# EAGLE design ttd (EAGLE 6.4)
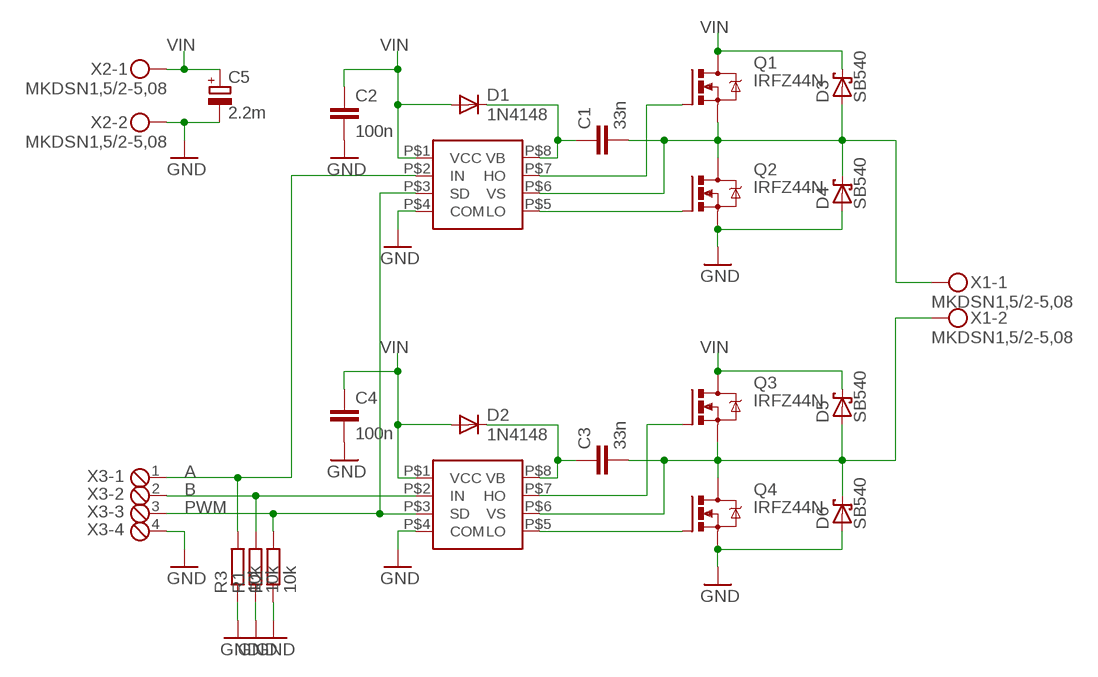
[diagram p0: schematic, sheet 1]

## Parts
C1  33n  C-EU050-025X075  [C050-025X075]
C2  100n  C-EU075-032X103  [C075-032X103]
C3  33n  C-EU050-025X075  [C050-025X075]
C4  100n  C-EU075-032X103  [C075-032X103]
C5  2.2m  CPOL-EUE7.5-18  [E7,5-18]
D1  1N4148  1N4148DO35-10  [DO35-10]
D2  1N4148  1N4148DO35-10  [DO35-10]
D3  SB540  SCHOTTKY-DIODEDO201T15  [DO201T15]
D4  SB540  SCHOTTKY-DIODEDO201T15  [DO201T15]
D5  SB540  SCHOTTKY-DIODEDO201T15  [DO201T15]
D6  SB540  SCHOTTKY-DIODEDO201T15  [DO201T15]
Q1  IRFZ44N  IRF540  [TO220BV]
Q2  IRFZ44N  IRF540  [TO220BV]
Q3  IRFZ44N  IRF540  [TO220BV]
Q4  IRFZ44N  IRF540  [TO220BV]
R1  10k  R-EU_0207/7  [0207/7]
R2  10k  R-EU_0207/7  [0207/7]
R3  10k  R-EU_0207/10  [0207/10]
U$1  IR2104  [IR2104_DIL]
U$2  IR2104  [IR2104_DIL]
X1  MKDSN1,5/2-5,08  [MKDSN1,5/2-5,08]
X2  MKDSN1,5/2-5,08  [MKDSN1,5/2-5,08]
X3  MPT4  [4POL254]

## Nets
A: R3.2 U$1.P$2(IN) X3.1
B: R1.2 U$2.P$2(IN) X3.2
GND [Supply]: C2.2 C4.2 C5.- D4.A D6.A Q2.S Q4.S R1.1 R2.1 R3.1 U$1.P$4(COM) U$2.P$4(COM) X2.2 X3.4
N$1: Q2.G U$1.P$5(LO)
N$2: Q4.G U$2.P$5(LO)
N$3: Q1.G U$1.P$7(HO)
N$4 [Motor]: C1.2 D3.A D4.C Q1.S Q2.D U$1.P$6(VS) X1.1
N$6: C1.1 D1.C U$1.P$8(VB)
N$7 [Motor]: C3.2 D5.A D6.C Q3.S Q4.D U$2.P$6(VS) X1.2
N$8: Q3.G U$2.P$7(HO)
N$9: C3.1 D2.C U$2.P$8(VB)
PWM: R2.2 U$1.P$3(SD) U$2.P$3(SD) X3.3
VIN [Supply]: C2.1 C4.1 C5.+ D1.A D2.A D3.C D5.C Q1.D Q3.D U$1.P$1(VCC) U$2.P$1(VCC) X2.1

## Library data of the parts
C1 C3 = rcl:C-EU: CAPACITOR, European symbol
C2 C4 = resistor:C-EU: CAPACITOR, European symbol
C5 = resistor:CPOL-EU: POLARIZED CAPACITOR, European symbol
D1 D2 = diode:1N4148: DIODE high speed (Philips)
D3-D6 = diode:SCHOTTKY-DIODE: Schottky Diode
Q1-Q4 = transistor-power:IRF540: HEXFET Power MOSFET
R1-R3 = resistor:R-EU_: RESISTOR, European symbol
U$1 U$2 = ttd:IR2104
X1 X2 = con-phoenix-508:MKDSN1,5/2-5,08: MKDSN 1,5/ 2-5,08 Printklemme Nennstrom: 13,5 A Nennspannung: 250 V Rastermaß: 5,08 mm Polzahl: 2 Anschlussart: Schraubanschluss Montage: Löten Anschlussrichtung Leiter/Platine: 0 ° Artikelnummer: 1729128 Source: http://eshop.phoenixcontact.com .. 1729128.pdf; MPN: MKDSN 1,5/2-5.08; OC_FARNELL: 1792903; OC_NEWARK: 30M2397
X3 = con-phoenix-254:MPT4: PHOENIX CONNECTOR; OC_FARNELL: unknown; OC_NEWARK: unknown

## Net classes
0 Signal: width 0.254 mm
1 Supply: width 1.016 mm
2 Motor: width 1.016 mm

## Board
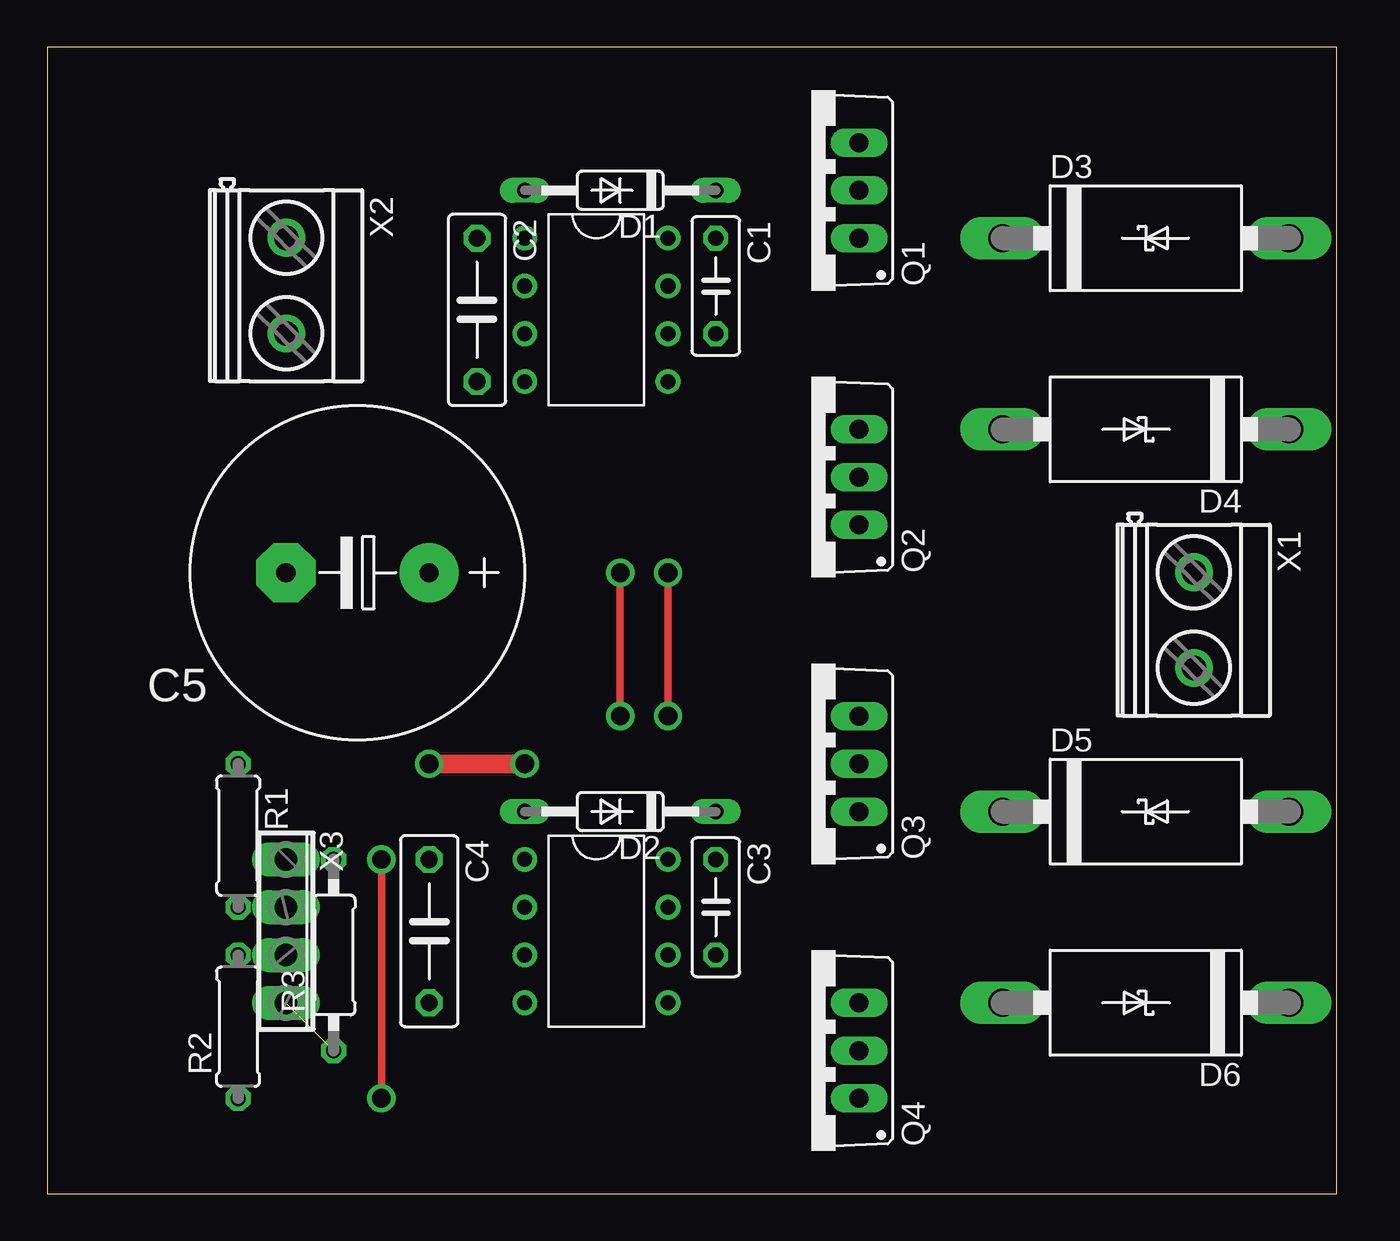
[diagram p1: board, top side]
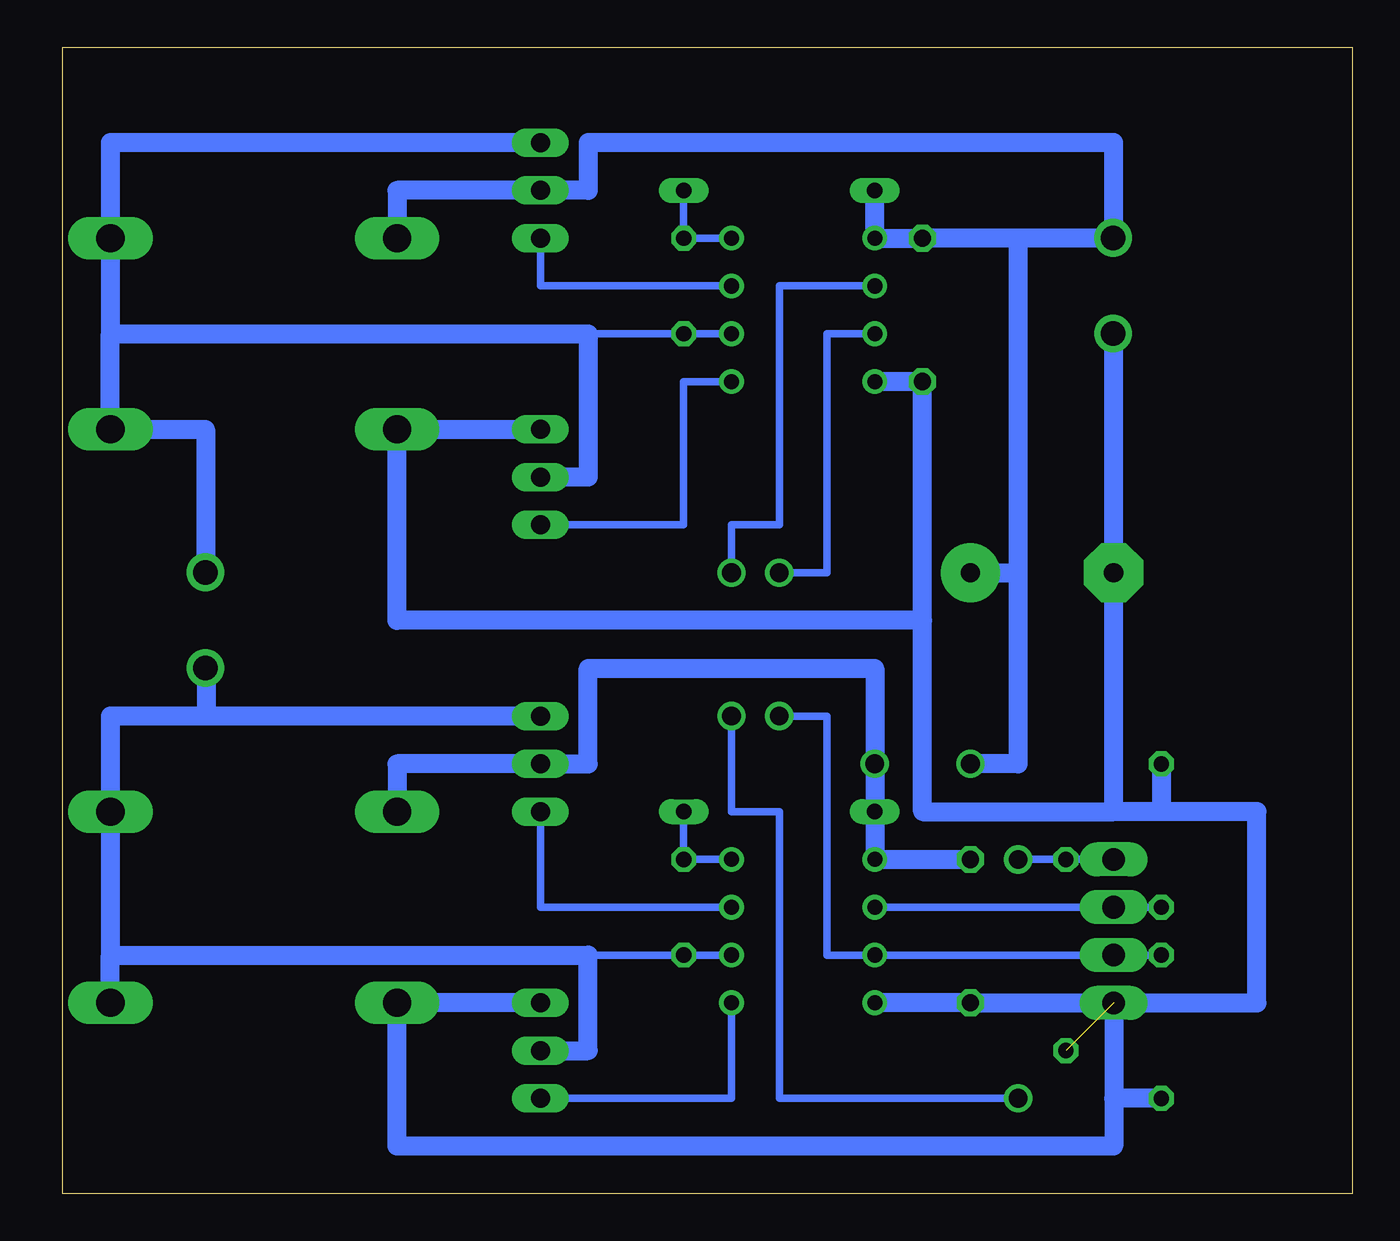
[diagram p2: board, bottom side, seen from below]

Size 68.58 x 60.96 mm. Coordinates in mm from the lower left corner, seen from the top.
Outline: 0,0 68.58,0 68.58,60.96 0,60.96 0,0
Copper layers (1*16): Top 0.035mm / dielectric 1.5mm / Bottom 0.035mm
Design rules "default *": minimum track width 10mil, minimum drill 24mil, track to track 8mil, track to pad 8mil, pad to pad 8mil, via to via 8mil, smd to smd 8mil, copper to edge 40mil, drill to drill 8mil, minimum pad ring 10mil, minimum via ring 8mil, stop-mask expansion 4mil, vias tented up to drill 0mil, thermal gap 10mil

### Footprints (pad centres in the part's own frame; a part is rotated, then mirrored left to right if it is on the bottom)
C050-025X075 = drill 0.813 octagon: 1 -2.54,0; 2 2.54,0
C075-032X103 = drill 0.914 octagon: 1 -3.81,0; 2 3.81,0
E7,5-18 = drill 1.016 pad 3.15: + -3.81,0 | drill 1.016 pad 3.15 octagon: - 3.81,0
DO35-10 = drill 0.813 long: A 5.08,0; C -5.08,0
DO201T15 = drill 1.499 long: A 7.62,0; C -7.62,0
TO220BV = drill 1.016 long: D 0,-2.54; G -2.54,-2.54; S 2.54,-2.54
0207/7 = drill 0.813 octagon: 1 -3.81,0; 2 3.81,0
0207/10 = drill 0.813 octagon: 1 -5.08,0; 2 5.08,0
IR2104_DIL = drill 0.8: P$1 -3.81,3.81; P$2 -3.81,1.27; P$3 -3.81,-1.27; P$4 -3.81,-3.81; P$5 3.81,-3.81; P$6 3.81,-1.27; P$7 3.81,1.27; P$8 3.81,3.81
MKDSN1,5/2-5,08 = drill 1.3 pad 2: 1 -2.561,0.025; 2 2.519,0.025
4POL254 = drill 1.2 long: 1 -3.81,0; 2 -1.27,0; 3 1.27,0; 4 3.81,0

### Placement (x,y rotation side)
C1  35.56,48.26 270 top
C2  22.86,46.99 270 top
C3  35.56,15.24 270 top
C4  20.32,13.97 270 top
C5  16.51,33.02 180 top
D1  30.48,53.34 180 top
D2  30.48,20.32 180 top
D3  58.42,50.8 0 top
D4  58.42,40.64 180 top
D5  58.42,20.32 0 top
D6  58.42,10.16 180 top
Q1  40.64,53.34 90 top
Q2  40.64,38.1 90 top
Q3  40.64,22.86 90 top
Q4  40.64,7.62 90 top
R1  10.16,19.05 270 top
R2  10.16,8.89 90 top
R3  15.24,12.7 90 top
U$1  29.21,46.99 0 top
U$2  29.21,13.97 0 top
X1  60.96,30.48 270 top
X2  12.7,48.26 270 top
X3  12.7,13.97 270 top

### Tracks (layer width: path | path; a pad name or v marks a point on that pad's centre or on a via)
A  (via drill 1)
  Top 0.406: v17.78,17.78 v17.78,5.08 | v33.02,25.4 v33.02,33.02
  Bottom 0.406: v17.78,17.78 R3.2 X3.1 | v33.02,33.02 33.02,35.56 30.48,35.56 30.48,48.26 U$1.P$2 | v17.78,5.08 30.48,5.08 30.48,20.32 33.02,20.32 v33.02,25.4
B
  Bottom 0.406: U$2.P$2 X3.2 R1.2
GND  (1 unrouted)
  Bottom 1.016: Q4.S D6.A 50.8,2.54 12.7,2.54 12.7,5.08 | Q2.S D4.A 50.8,30.48 22.86,30.48 | X3.4 12.7,5.08 | U$2.P$4 C4.2 X3.4 | X3.4 5.08,10.16 5.08,20.32 10.16,20.32 | 10.16,20.32 12.7,20.32 | 12.7,20.32 C5.- 12.7,45.72 12.72,45.72 X2.2 | 12.7,20.32 22.86,20.32 22.86,30.48 | 22.86,30.48 C2.2 U$1.P$4 | R1.1 10.16,20.32 | R2.1 12.7,5.08
N$1
  Bottom 0.406: U$1.P$5 35.56,43.18 35.56,35.56 Q2.G
N$2
  Bottom 0.406: U$2.P$5 33.02,5.08 Q4.G
N$3
  Bottom 0.406: U$1.P$7 43.18,48.26 Q1.G
N$4
  Bottom 0.406: U$1.P$6 C1.2 40.64,45.72
  Bottom 1.016: 66.04,45.72 D3.A 66.04,55.88 Q1.S | 66.04,45.72 D4.C 60.98,40.64 X1.1 | 66.04,45.72 40.64,45.72 40.64,38.1 Q2.D
N$6
  Bottom 0.406: D1.C C1.1 U$1.P$8
N$7
  Bottom 0.406: U$2.P$6 C3.2 40.64,12.7
  Bottom 1.016: Q3.S 60.96,25.4 | 60.96,25.4 66.04,25.4 D5.A 66.04,12.7 | D6.C 66.04,12.7 | 66.04,12.7 40.64,12.7 40.64,7.62 Q4.D | X1.2 60.96,27.96 60.96,25.4
N$8
  Bottom 0.406: U$2.P$7 43.18,15.24 Q3.G
N$9
  Bottom 0.406: U$2.P$8 C3.1 D2.C
PWM  (via drill 1)
  Top 0.406: v30.48,25.4 v30.48,33.02
  Bottom 0.406: v30.48,25.4 27.94,25.4 27.94,12.7 U$2.P$3 X3.3 R2.2 | v30.48,33.02 27.94,33.02 27.94,45.72 U$1.P$3
VIN  (via drill 1)
  Top 1.016: v20.32,22.86 v25.4,22.86
  Bottom 1.016: D5.C 50.8,22.86 Q3.D 40.64,22.86 40.64,27.94 25.4,27.94 v25.4,22.86 D2.A U$2.P$1 C4.1 | D3.C 50.8,53.34 Q1.D 40.64,53.34 40.64,55.88 12.72,55.88 | D1.A U$1.P$1 C2.1 17.78,50.8 | 12.7,55.88 12.72,55.88 | 12.72,55.88 X2.1 12.72,50.8 17.78,50.8 | 17.78,50.8 17.78,33.02 | C5.+ 17.78,33.02 | 17.78,33.02 17.78,22.86 v20.32,22.86